# EAGLE design Elektriskeem (EAGLE 9.6.2)
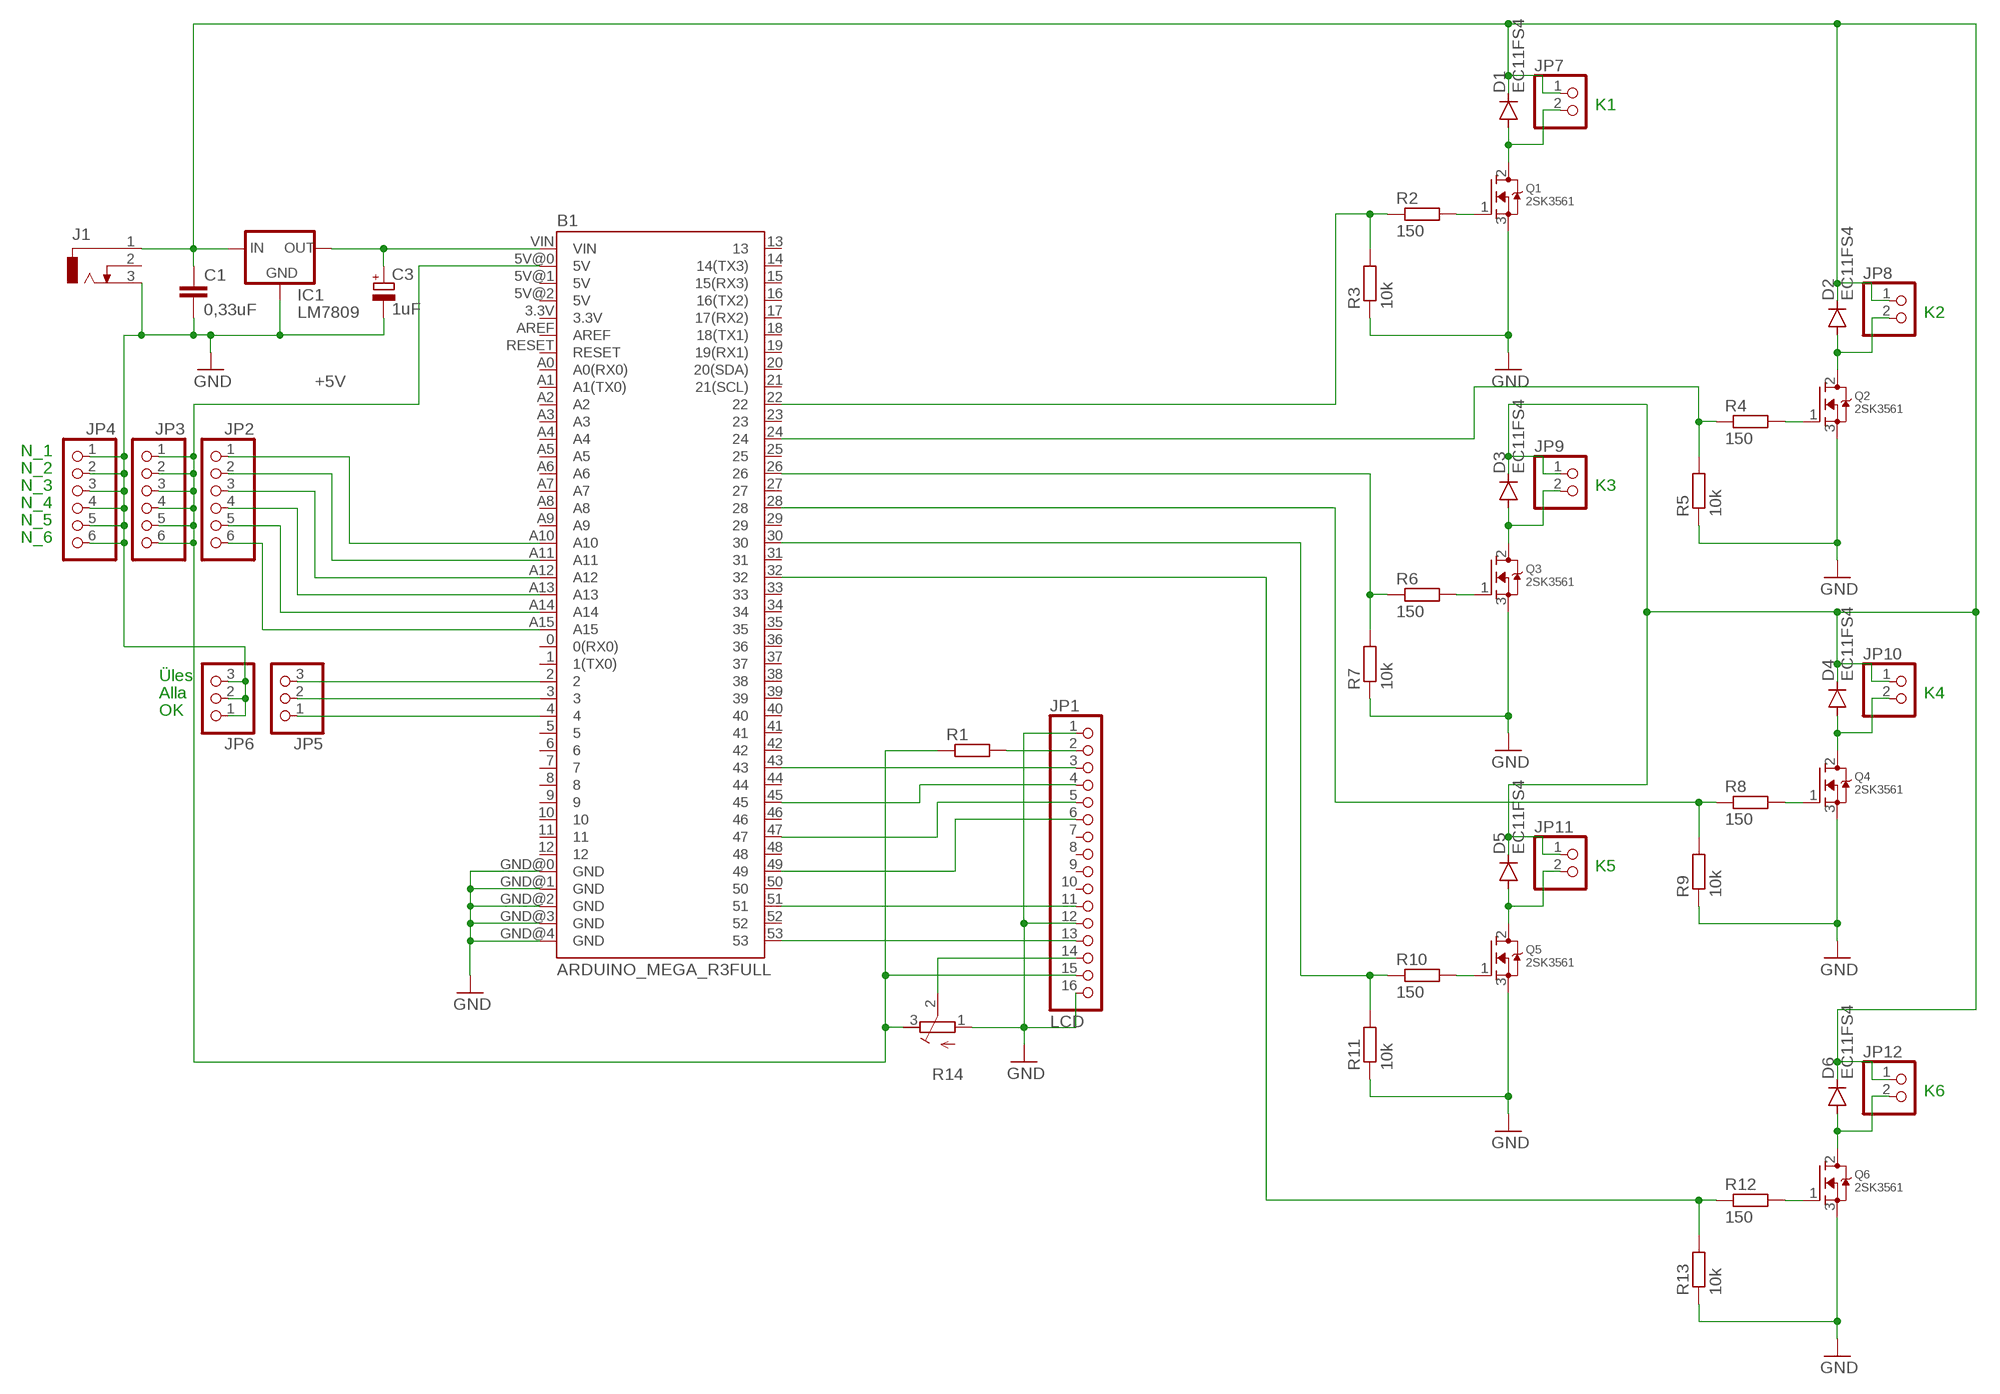
[diagram p0: schematic, sheet 1]

## Parts
B1  ARDUINO_MEGA_R3FULL  [ARDUINO_MEGA]
C1  0,33uF  C-EU102-043X133  [C102-043X133]
C3  1uF  CPOL-EUE2.5-6  [E2,5-6]
D1  EC11FS4  DIODE-DO214AA  [DO214AA]
D2  EC11FS4  DIODE-DO214AA  [DO214AA]
D3  EC11FS4  DIODE-DO214AA  [DO214AA]
D4  EC11FS4  DIODE-DO214AA  [DO214AA]
D5  EC11FS4  DIODE-DO214AA  [DO214AA]
D6  EC11FS4  DIODE-DO214AA  [DO214AA]
IC1  LM7809  78XXS  [78XXS]
J1  DCJ0303  [DCJ0303]
JP1  LCD  PINHD-1X16  [1X16]
JP2  PINHD-1X6  [1X06]
JP3  PINHD-1X6  [1X06]
JP4  PINHD-1X6  [1X06]
JP5  PINHD-1X3  [1X03]
JP6  PINHD-1X3  [1X03]
JP7  PINHD-1X2  [1X02]
JP8  PINHD-1X2  [1X02]
JP9  PINHD-1X2  [1X02]
JP10  PINHD-1X2  [1X02]
JP11  PINHD-1X2  [1X02]
JP12  PINHD-1X2  [1X02]
Q1  2SK3561  MOSFET-NGDS_TO220V  [TO220V]
Q2  2SK3561  MOSFET-NGDS_TO220V  [TO220V]
Q3  2SK3561  MOSFET-NGDS_TO220V  [TO220V]
Q4  2SK3561  MOSFET-NGDS_TO220V  [TO220V]
Q5  2SK3561  MOSFET-NGDS_TO220V  [TO220V]
Q6  2SK3561  MOSFET-NGDS_TO220V  [TO220V]
R1  R-EU_0207/12  [0207/12]
R2  150  R-EU_0207/12  [0207/12]
R3  10k  R-EU_0207/12  [0207/12]
R4  150  R-EU_0207/12  [0207/12]
R5  10k  R-EU_0207/12  [0207/12]
R6  150  R-EU_0207/12  [0207/12]
R7  10k  R-EU_0207/12  [0207/12]
R8  150  R-EU_0207/12  [0207/12]
R9  10k  R-EU_0207/12  [0207/12]
R10  150  R-EU_0207/12  [0207/12]
R11  10k  R-EU_0207/12  [0207/12]
R12  150  R-EU_0207/12  [0207/12]
R13  10k  R-EU_0207/12  [0207/12]
R14  R-TRIMM3339P  [RTRIM3339P]

## Nets
+5V: B1.5V@0(5V) JP1.15 JP3.1 JP3.2 JP3.3 JP3.4 JP3.5 JP3.6 R1.1 R14.3(E)
GND: B1.GND@0(GND) B1.GND@1(GND) B1.GND@2(GND) B1.GND@3(GND) B1.GND@4(GND) C1.2 C3.- IC1.GND J1.3 JP1.1 JP1.12 JP1.16 JP4.1 JP4.2 JP4.3 JP4.4 JP4.5 JP4.6 JP6.1 JP6.2 JP6.3 Q1.3(S) Q2.3(S) Q3.3(S) Q4.3(S) Q5.3(S) Q6.3(S) R3.1 R5.1 R7.1 R9.1 R11.1 R13.1 R14.1(A)
N$1: C1.1 D1.C D2.C D3.C D4.C D5.C D6.C IC1.IN J1.1 JP7.1 JP8.1 JP9.1 JP10.1 JP11.1 JP12.1
N$2: B1.2 JP5.3
N$3: B1.VIN C3.+ IC1.OUT
N$4: B1.A15 JP2.6
N$5: B1.26 R6.1 R7.2
N$6: B1.A14 JP2.5
N$7: B1.A13 JP2.4
N$8: B1.A12 JP2.3
N$9: B1.A11 JP2.2
N$10: B1.A10 JP2.1
N$11: B1.43 JP1.3
N$12: B1.53 JP1.13
N$13: JP1.2 R1.2
N$14: JP1.14 R14.2(S)
N$15: B1.51 JP1.11
N$16: B1.45 JP1.4
N$17: B1.47 JP1.5
N$18: B1.49 JP1.6
N$19: B1.3 JP5.2
N$20: B1.4 JP5.1
N$21: Q1.1(G) R2.2
N$22: D1.A JP7.2 Q1.2(D)
N$23: B1.22 R2.1 R3.2
N$25: D3.A JP9.2 Q3.2(D)
N$26: Q3.1(G) R6.2
N$29: D5.A JP11.2 Q5.2(D)
N$30: Q5.1(G) R10.2
N$31: B1.30 R10.1 R11.2
N$33: D2.A JP8.2 Q2.2(D)
N$34: Q2.1(G) R4.2
N$35: B1.24 R4.1 R5.2
N$37: D4.A JP10.2 Q4.2(D)
N$38: Q4.1(G) R8.2
N$39: B1.28 R8.1 R9.2
N$41: D6.A JP12.2 Q6.2(D)
N$42: Q6.1(G) R12.2
N$43: B1.32 R12.1 R13.2
Unconnected: B1.0(0(RX0)) B1.1(1(TX0)) B1.3.3V B1.5 B1.5V@1(5V) B1.5V@2(5V) B1.6 B1.7 B1.8 B1.9 B1.10 B1.11 B1.12 B1.13 B1.14(14(TX3)) B1.15(15(RX3)) B1.16(16(TX2)) B1.17(17(RX2)) B1.18(18(TX1)) B1.19(19(RX1)) B1.20(20(SDA)) B1.21(21(SCL)) B1.23 B1.25 B1.27 B1.29 B1.31 B1.33 B1.34 B1.35 B1.36 B1.37 B1.38 B1.39 B1.40 B1.41 B1.42 B1.44 B1.46 B1.48 B1.50 B1.52 B1.A0(A0(RX0)) B1.A1(A1(TX0)) B1.A2 B1.A3 B1.A4 B1.A5 B1.A6 B1.A7 B1.A8 B1.A9 B1.AREF B1.RESET J1.2 JP1.7 JP1.8 JP1.9 JP1.10

## Notes on the sheet
- K1
- K2
- N_1
- N_2
- N_3 | K3
- N_4
- N_5
- N_6
- Üles
- Alla | K4
- OK
- K5
- K6

## Library data of the parts
B1 = SparkFun-Boards:ARDUINO_MEGA_R3: Arduino Mega R3 ATmega2560 R3 compatible footprint. SparkFun Products: Arduino Mega 2560 R3 <https://www.sparkfun.com/products/11061>
C1 = rcl:C-EU: CAPACITOR, European symbol; SPICEPREFIX: C
C3 = rcl:CPOL-EU: POLARIZED CAPACITOR, European symbol; SPICEPREFIX: C
D1-D6 = diode:DIODE-: DIODE
IC1 = v-reg:78XXS: VOLTAGE REGULATOR
J1 = con-jack:DCJ0303: DC POWER JACK Source: DCJ0303.pdf; OC_FARNELL: unknown; OC_NEWARK: unknown
JP1 = pinhead:PINHD-1X16: PIN HEADER
JP2-JP4 = pinhead:PINHD-1X6: PIN HEADER
JP5 JP6 = pinhead:PINHD-1X3: PIN HEADER
JP7-JP12 = pinhead:PINHD-1X2: PIN HEADER
Q1-Q6 = adafruit:MOSFET-N: N-Channel Mosfet 2N7002E - 60V 260mA SOT23 [Digikey: 2N7002ET1GOSTR-ND] - REEL BSH103 - 30V 850mA SOT23 [Digikey: 568-5013-1-ND]
R1-R13 = rcl:R-EU_: RESISTOR, European symbol; SPICEPREFIX: R
R14 = rcl:R-TRIMM: Trimm resistor; SPICEMODEL: X; SPICEPREFIXL: POT

## Board
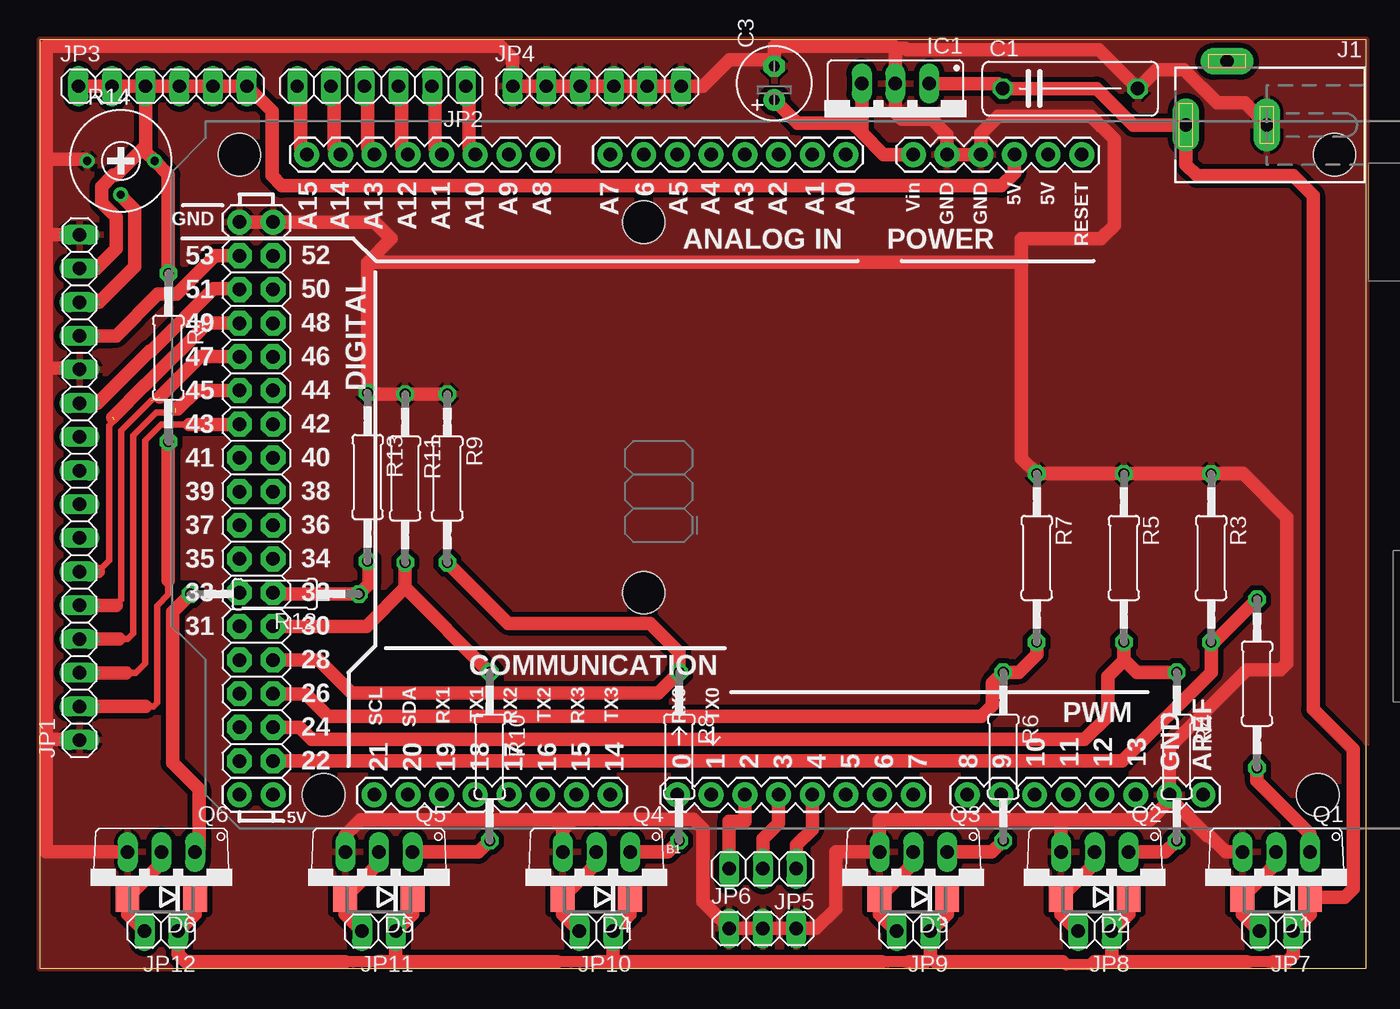
[diagram p1: board, top side]

Size 100 x 70 mm. Coordinates in mm from the lower left corner, seen from the top.
Outline: 0,0 100,0 100,70 0,70 0,0
Copper layers (1*16): Top 0.035mm / dielectric 1.5mm / Bottom 0.035mm
Design rules "default *": minimum track width 0.5mm, minimum drill 0.35mm, track to track 0.4mm, track to pad 0.4mm, pad to pad 0.4mm, via to via 0.4mm, smd to smd 0mil, copper to edge 0mil, drill to drill 0.5mm, minimum pad ring 10mil, minimum via ring 8mil, stop-mask expansion 4mil, vias tented up to drill 0mil, thermal gap 10mil

### Footprints (pad centres in the part's own frame; a part is rotated, then mirrored left to right if it is on the bottom)
ARDUINO_MEGA = drill 1.016 pad 1.88: 0 13.97,24.13; 1 11.43,24.13; 2 8.89,24.13; 3 6.35,24.13; 3.3V -13.97,-24.13; 4 3.81,24.13; 5 1.27,24.13; 5V@0 -11.43,-24.13; 5V@1 44.45,24.13; 5V@2 46.99,24.13; 6 -1.27,24.13; 7 -3.81,24.13; 8 -7.874,24.13; 9 -10.414,24.13; 10 -12.954,24.13; 11 -15.494,24.13; 12 -18.034,24.13; 13 -20.574,24.13; 14 19.05,24.13; 15 21.59,24.13; 16 24.13,24.13; 17 26.67,24.13; 18 29.21,24.13; 19 31.75,24.13; 20 34.29,24.13; 21 36.83,24.13; A0 1.27,-24.13; A1 3.81,-24.13; A2 6.35,-24.13; A3 8.89,-24.13; A4 11.43,-24.13; A5 13.97,-24.13; A6 16.51,-24.13; A7 19.05,-24.13; A8 24.13,-24.13; A9 26.67,-24.13; A10 29.21,-24.13; A11 31.75,-24.13; A12 34.29,-24.13; A13 36.83,-24.13; A14 39.37,-24.13; A15 41.91,-24.13; AREF -25.654,24.13; GND@0 -8.89,-24.13; GND@1 -6.35,-24.13; GND@2 44.45,-19.05; GND@3 46.99,-19.05; GND@4 -23.114,24.13; RESET -16.51,-24.13; VIN -3.81,-24.13 | drill 1.016 pad 1.88 octagon: 22 44.45,21.59; 23 46.99,21.59; 24 44.45,19.05; 25 46.99,19.05; 26 44.45,16.51; 27 46.99,16.51; 28 44.45,13.97; 29 46.99,13.97; 30 44.45,11.43; 31 46.99,11.43; 32 44.45,8.89; 33 46.99,8.89; 34 44.45,6.35; 35 46.99,6.35; 36 44.45,3.81; 37 46.99,3.81; 38 44.45,1.27; 39 46.99,1.27; 40 44.45,-1.27; 41 46.99,-1.27; 42 44.45,-3.81; 43 46.99,-3.81; 44 44.45,-6.35; 45 46.99,-6.35; 46 44.45,-8.89; 47 46.99,-8.89; 48 44.45,-11.43; 49 46.99,-11.43; 50 44.45,-13.97; 51 46.99,-13.97; 52 44.45,-16.51; 53 46.99,-16.51 | hole 3.2: -34.29,24.13; -35.56,-24.13; 16.51,8.89; 16.51,-19.05; 40.64,24.13; 46.99,-24.13
C102-043X133 = drill 1.016 octagon: 1 -5.08,0; 2 5.08,0
E2,5-6 = drill 0.813 pad 1.6: + -1.27,0 | drill 0.813 pad 1.6 octagon: - 1.27,0
DO214AA = smd 1.8 x 2.2: A 2.55,0; C -2.55,0
78XXS = drill 1.016 long: GND 0,-2.54; IN -2.54,-2.54; OUT 2.54,-2.54
DCJ0303 = drill 1 pad 2 long: 1 0,3.1; 2 4.8,0; 3 0,-3
1X16 = drill 1.016 long: 1 -19.05,0; 2 -16.51,0; 3 -13.97,0; 4 -11.43,0; 5 -8.89,0; 6 -6.35,0; 7 -3.81,0; 8 -1.27,0; 9 1.27,0; 10 3.81,0; 11 6.35,0; 12 8.89,0; 13 11.43,0; 14 13.97,0; 15 16.51,0; 16 19.05,0
1X06 = drill 1.016 long: 1 -6.35,0; 2 -3.81,0; 3 -1.27,0; 4 1.27,0; 5 3.81,0; 6 6.35,0
1X03 = drill 1.016 long: 1 -2.54,0; 2 0,0; 3 2.54,0
1X02 = drill 1.016 long: 1 -1.27,0; 2 1.27,0
TO220V = drill 1.016 long: 1 -2.54,-2.54; 2 0,-2.54; 3 2.54,-2.54
0207/12 = drill 0.813 octagon: 1 -6.35,0; 2 6.35,0
RTRIM3339P = drill 0.61: 1 -2.54,0; 2 0,-2.54; 3 2.54,0

### Placement (x,y rotation side)
B1  62.04,37.21 180 top
C1  77.68,66.32 0 top
C3  55.37,66.73 90 top
D1  93.21,5.36 180 top
D2  79.53,5.36 180 top
D3  65.85,5.36 180 top
D4  41.96,5.36 180 top
D5  25.56,5.36 180 top
D6  9.16,5.36 180 top
IC1  64.5,64.16 180 top
J1  89.5,63.58 90 top
JP1  3,36.25 90 top
JP2  25.75,66.5 180 top
JP3  9.25,66.5 0 top
JP4  42,66.5 0 top
JP5  54.5,7.5 180 top
JP6  54.5,3 0 top
JP7  93.21,2.8 180 top
JP8  79.53,2.8 180 top
JP9  65.85,2.8 180 top
JP10  41.96,2.8 180 top
JP11  25.56,2.8 180 top
JP12  9.16,2.8 180 top
Q1  93.21,6.22 180 top
Q2  79.53,6.22 180 top
Q3  65.85,6.22 180 top
Q4  41.96,6.22 180 top
Q5  25.56,6.22 180 top
Q6  9.16,6.22 180 top
R1  9.69,46.04 270 top
R2  91.76,21.46 270 top
R3  88.3,30.94 270 top
R4  85.71,15.96 270 top
R5  81.72,30.94 270 top
R6  72.63,15.96 270 top
R7  75.15,30.94 270 top
R8  48.2,15.96 270 top
R9  30.72,36.94 270 top
R10  33.92,15.96 270 top
R11  27.54,36.94 270 top
R12  17.71,28.21 180 top
R13  24.71,37.04 270 top
R14  6.11,60.87 0 top

### Tracks (layer width: path | path; a pad name or v marks a point on that pad's centre or on a via)
+5V
  Top 1: JP3.1 JP3.2 JP3.3 | JP3.3 JP3.4 JP3.5 JP3.6 17.5,64.6 17.5,59.75 18.25,59 72.5,59 73.5,60 73.47,60.03 B1.5V@0 | JP3.3 7.98,62 | 7.98,62 7.98,61.54 R14.3 9.69,59.83 R1.1 | 7.98,62 5.77,59.79 5.51,59.79 4.65,58.93 4.65,57.73 5.75,56.63 5.75,54.25 4.26,52.76 JP1.15
GND
  Top 1: 0.5,55.3 JP1.16 | 74,53.25 24.75,53.25 | B1.GND@3 B1.GND@2 25.25,56.25 26.5,55 24.75,53.25 | 0.5,45.25 0.5,55.3 | R9.1 R11.1 24.81,43.29 R13.1 24.71,53.21 24.75,53.25 | 74,53.25 74,38.44 R7.1 R5.1 R3.1 90.71,37.29 94,34 94,23 93.5,22.5 91,22.5 85.15,16.65 B1.GND@4 85.15,12.85 | 74,53.25 74,55 80,55 81,56 81,62.5 79.25,64.25 72.25,64.25 70.93,62.93 B1.GND@0 B1.GND@1 68.39,62.86 67.25,64 65,64 64.5,64.5 IC1.GND 64.5,69.37 | Q6.3 0.5,8.76 0.5,17.25 | Q1.3 89.42,8.76 88.18,10 88,10 85.15,12.85 | 76.99,11.2 83.7,11.2 85.15,12.65 | 85.15,12.65 85.25,12.75 | Q2.3 76.99,11.2 | 76.99,11.2 63.31,11.2 Q3.3 60,8.76 60,4.5 58.5,3 JP6.3 JP6.2 JP6.1 51.96,3.04 50,5 50,10.5 49.28,11.22 40.25,11.22 | 40.25,11.22 38.07,11.22 | Q5.3 23.02,10.02 24.2,11.2 38.75,11.2 39.42,10.53 Q4.3 39.42,10.38 40.25,11.22 | J1.3 90.83,65.25 88.75,65.25 86.25,67.75 84.19,67.75 C1.2 79.83,69.25 65.35,69.25 65.23,69.37 64.5,69.37 | 64.5,69.37 64.37,69.5 55.37,69.5 C3.- 54.87,68.5 52,68.5 50,66.5 JP4.6 JP4.5 JP4.4 JP4.3 JP4.2 JP4.1 35.65,68.6 34.75,69.5 0.5,69.5 0.5,61 | 0.5,61 0.5,55.3 | R14.1 3.44,61 0.5,61 | 0.5,45.25 2.89,45.25 JP1.12 | 0.5,17.25 0.5,45.25 | JP1.1 2.95,17.25 0.5,17.25 | 85.15,12.65 85.15,12.85
  pour Top: 100,0 100,70 0,70 0,0
N$1
  Top 0.813: 93,0.5 92.62,0.5 92.59,0.47 91.29,0.47 91.26,0.5 91,0.5 | 79.5,0.5 79.25,0.25 77.38,0.25 77.12,0.5 | 65.5,0.5 65.26,0.5 65.23,0.47 63.93,0.47 63.9,0.5 63.5,0.5 | 42,0.5 41.37,0.5 41.34,0.47 40.04,0.47 40.01,0.5 39,0.5 | 25.5,0.5 24.97,0.5 24.94,0.47 23.64,0.47 23.61,0.5 23,0.5
  Top 1: 93,0.5 94,0.5 94.48,0.98 JP7.1 95.76,4.08 D1.C 98.36,5.36 99,6 99,16.5 96,19.5 96,58.25 94.5,59.75 87.25,59.75 86.4,60.6 J1.1 82.42,63.58 79.68,66.32 C1.1 72.22,66.7 IC1.IN | 81,0.5 91,0.5 | D2.C 82.08,4.08 JP8.1 80.8,0.7 81,0.5 | 81,0.5 79.5,0.5 | D3.C 68.4,4.08 JP9.1 67.12,0.88 | 77.12,0.5 67.5,0.5 67.12,0.88 | 67.12,0.88 66.75,0.5 65.5,0.5 | 43.23,0.77 43.5,0.5 63.5,0.5 | 43.23,0.77 JP10.1 44.51,4.08 D4.C | 43.23,0.77 42.95,0.5 42,0.5 | 39,0.5 27,0.5 | 27,0.5 26.83,0.67 JP11.1 28.11,4.08 D5.C | 27,0.5 25.5,0.5 | 23,0.5 11,0.5 10.43,1.07 JP12.1 11.71,4.08 D6.C
N$2
  Top 1: JP5.3 51.96,11.08 53.15,11.08 B1.2
N$3
  Top 1: B1.VIN 63.6,61.34 61.96,62.98 | 61.96,62.98 61.23,63.71 57.12,63.71 C3.+ | IC1.OUT 61.96,62.98
N$4
  Top 1: JP2.6 19.65,66.25 19.65,61.82 B1.A15
N$5
  Top 1: R7.2 75.15,23.65 73.81,22.31 R6.1 71.82,21.5 71.82,19.82 71,19 21.75,19 20.05,20.7 B1.26
N$6
  Top 1: JP2.5 22.19,66.25 22.19,61.82 B1.A14
N$7
  Top 1: JP2.4 24.73,66.25 24.73,61.82 B1.A13
N$8
  Top 1: JP2.3 27.27,66.25 27.27,61.82 B1.A12
N$9
  Top 1: JP2.2 29.81,66.25 29.81,61.82 B1.A11
N$10
  Top 1: JP2.1 32.35,66.25 32.35,61.82 B1.A10
N$11
  Top 0.5: 6.5,22.28 7.23,22.28 7.95,23 7.95,39.8 9.15,41 11.25,41
  Top 1: B1.43 15.03,41 11.25,41 | JP1.3 6.5,22.28
N$12
  Top 0.5: 5.5,47.68 5.75,47.68 | 14.75,53.72 B1.53
  Top 1: JP1.13 5.5,47.68 | 5.75,47.68 8.9,50.83 10.34,50.83 13.23,53.72 14.75,53.72
N$13
  Top 0.5: 8,19.74 8.59,19.74 8.85,20 8.85,27.32 9.69,28.16 9.69,29.25
  Top 1: R1.2 9.69,29.25 | JP1.2 8,19.74
N$14
  Top 1: R14.2 6.11,58.25 7.15,57.21 7.15,52.9 4.47,50.22 JP1.14
N$15
  Top 0.5: 14.98,51.25 B1.51
  Top 1: JP1.11 4.35,42.6 8.28,46.53 8.41,46.53 13.13,51.25 14.98,51.25
N$16  (1 unrouted)
  Top 0.5: 6,24.82 6.62,24.82 7.05,25.25 7.05,40.18 8.77,41.9 10.25,41.9
  Top 1: B1.45 11.81,43.56 10.4,42.15 10.25,42.15 10.25,42.25 | JP1.4 6,24.82
N$17  (1 unrouted)
  Top 0.5: 5.76,27.36 6.15,27.75 6.15,40.55 8.4,42.8
  Top 1: 9.03,43.05 12.08,46.1 B1.47 | JP1.5 5.76,27.36
N$18  (1 unrouted)
  Top 0.5: 5.66,41.34 5.25,40.92 5.25,30.75 4.4,29.9
  Top 1: B1.49 12.86,48.64 12.75,48.75 7.95,43.95 7.92,43.95 5.49,41.51 | JP1.6 4.4,29.9
N$19
  Top 1: JP5.2 54.5,9.75 55.69,10.94 B1.3
N$20
  Top 1: JP5.1 57.04,9.29 58.23,10.48 B1.4
N$21
  Top 1: Q1.1 95.75,10.12 91.76,14.11 R2.2
N$22
  Top 1: Q1.2 93.21,7.91 D1.A 90.66,4.08 JP7.2
N$23
  Top 1: B1.22 26,15.62 26.9,15.62 81.62,15.62 88.3,22.3 R3.2 88.53,24.59 R2.1
N$25
  Top 1: Q3.2 65.85,7.91 D3.A 63.3,4.08 JP9.2
N$26
  Top 1: R6.2 71.78,8.76 Q3.1
N$29
  Top 1: Q5.2 25.56,7.91 D5.A 23.01,4.08 JP11.2
N$30
  Top 1: R10.2 33.07,8.76 Q5.1
N$31
  Top 1: R11.2 27.54,28.69 | 27.54,28.69 R10.1 | B1.30 24.63,25.78 27.54,28.69
N$33
  Top 1: Q2.2 79.53,7.91 D2.A 76.98,4.08 JP8.2
N$34
  Top 1: R4.2 84.86,8.76 Q2.1
N$35
  Top 1: R4.1 82.69,22.31 81.72,23.27 R5.2 81.72,23.23 80.5,22 80.5,19 78.75,17.25 20.5,17.25 19.59,18.16 B1.24
N$37
  Top 1: Q4.2 41.96,7.91 D4.A 39.41,4.08 JP10.2
N$38
  Top 1: R8.2 47.35,8.76 Q4.1
N$39
  Top 1: R9.2 35.31,26 46,26 48.2,23.8 R8.1 46.64,20.75 23.5,20.75 21.01,23.24 B1.28
N$41
  Top 1: Q6.2 9.16,7.91 D6.A 6.61,4.08 JP12.2
N$42
  Top 1: R12.2 10,26.85 10,15.5 12,13.5 12,9.06 Q6.1
N$43
  Top 1: B1.32 17.7,28.21 R12.1 24.81,28.96 24.81,30.29 24.71,30.39 R13.2